# Altium schematic sheet 通讯部分(1).SchDoc
size 386 x 203 mm
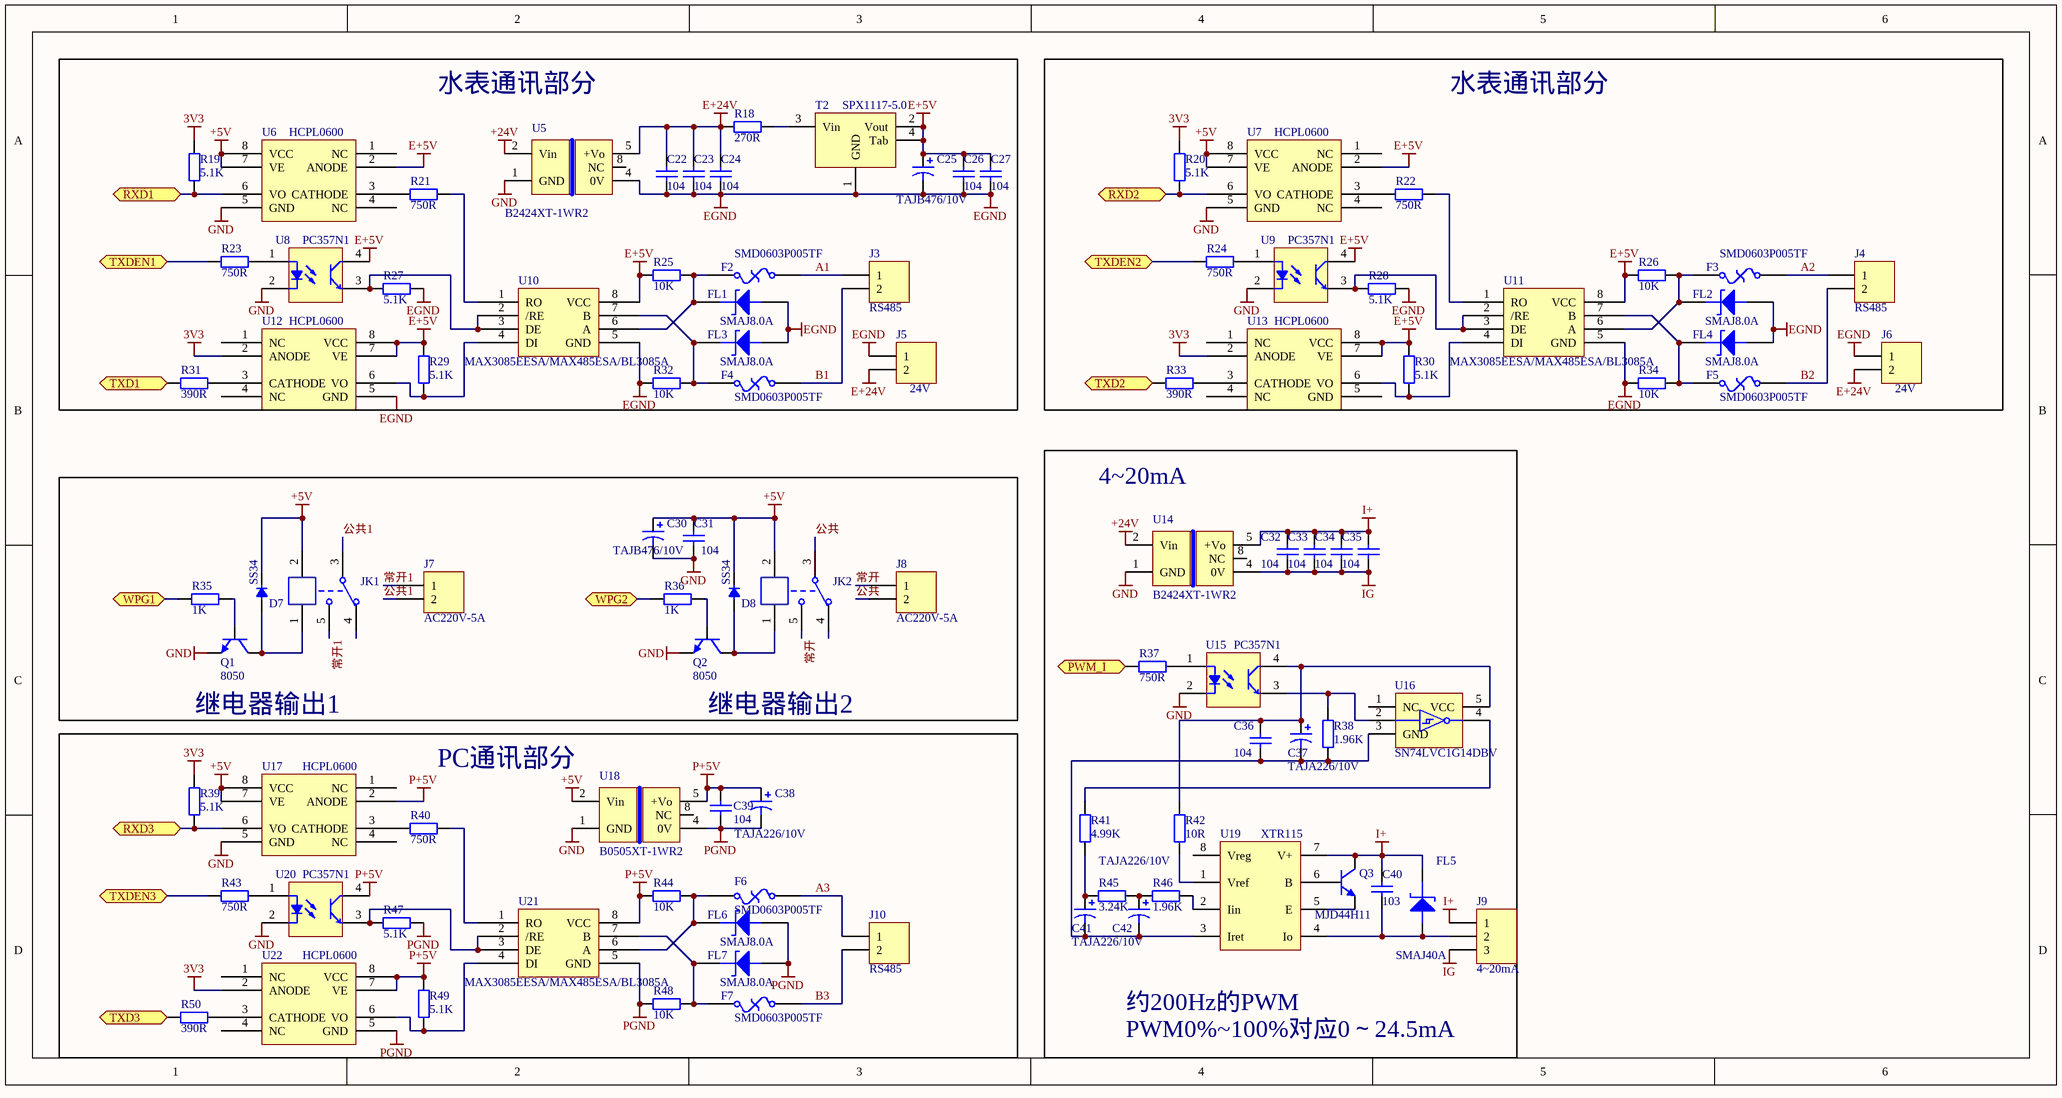
[diagram p0: 通讯部分(1).SchDoc]

## Parts
C22  104  [C 0603_M]
C23  104  [C 0603_M]
C24  104  [C 0603_M]
C25  TAJB476/10V  [3528]
C26  104  [C 0603_M]
C27  104  [C 0603_M]
C30  TAJB476/10V  [3528]
C31  104  [C 0603_M]
C32  104  [C 0603_M]
C33  104  [C 0603_M]
C34  104  [C 0603_M]
C35  104  [C 0603_M]
C36  104  [C 0603_M]
C37  TAJA226/10V  [3216]
C38  TAJA226/10V  [3216]
C39  104  [C 0603_M]
C40  103  [C 0603_M]
C41  TAJA226/10V  [3216]
C42  TAJA226/10V  [3216]
D7  SS34  [SMA]
D8  SS34  [SMA]
F2  SMD0603P005TF  [R 0603_M]
F3  SMD0603P005TF  [R 0603_M]
F4  SMD0603P005TF  [R 0603_M]
F5  SMD0603P005TF  [R 0603_M]
F6  SMD0603P005TF  [R 0603_M]
F7  SMD0603P005TF  [R 0603_M]
FL1  SMAJ8.0A  [SMA]
FL2  SMAJ8.0A  [SMA]
FL3  SMAJ8.0A  [SMA]
FL4  SMAJ8.0A  [SMA]
FL5  SMAJ40A  [SMA]
FL6  SMAJ8.0A  [SMA]
FL7  SMAJ8.0A  [SMA]
J3  RS485  [KF128-5.08-2P]
J4  RS485  [KF128-5.08-2P]
J5  24V  [KF128-5.08-2P]
J6  24V  [KF128-5.08-2P]
J7  AC220V-5A  [KF128-5.08-2P]
J8  AC220V-5A  [KF128-5.08-2P]
J9  4~20mA  [KF128-5.08-3P]
J10  RS485  [KF128-5.08-2P]
JK1  (no value)  [SRD-C_B]
JK2  (no value)  [SRD-C_B]
Q1  8050  [SOT-23]
Q2  8050  [SOT-23]
Q3  MJD44H11  [DPAK]
R18  270R  [R 1206_M]
R19  5.1K  [R 0603_M]
R20  5.1K  [R 0603_M]
R21  750R  [R 0603_M]
R22  750R  [R 0603_M]
R23  750R  [R 0603_M]
R24  750R  [R 0603_M]
R25  10K  [R 0603_M]
R26  10K  [R 0603_M]
R27  5.1K  [R 0603_M]
R28  5.1K  [R 0603_M]
R29  5.1K  [R 0603_M]
R30  5.1K  [R 0603_M]
R31  390R  [R 0603_M]
R32  10K  [R 0603_M]
R33  390R  [R 0603_M]
R34  10K  [R 0603_M]
R35  1K  [R 0603_M]
R36  1K  [R 0603_M]
R37  750R  [R 0603_M]
R38  1.96K  [R 0603_M]
R39  5.1K  [R 0603_M]
R40  750R  [R 0603_M]
R41  4.99K  [R 0603_M]
R42  10R  [R 0603_M]
R43  750R  [R 0603_M]
R44  10K  [R 0603_M]
R45  3.24K  [R 0603_M]
R46  1.96K  [R 0603_M]
R47  5.1K  [R 0603_M]
R48  10K  [R 0603_M]
R49  5.1K  [R 0603_M]
R50  390R  [R 0603_M]
T2  SPX1117-5.0  [SOT-223]
U5  B2424XT-1WR2  [B_XT-1W]
U6  HCPL0600  [SO-8]
U7  HCPL0600  [SO-8]
U8  PC357N1  [PC357]
U9  PC357N1  [PC357]
U10  MAX3085EESA/MAX485ESA/BL3085A  [SO-8]
U11  MAX3085EESA/MAX485ESA/BL3085A  [SO-8]
U12  HCPL0600  [SO-8]
U13  HCPL0600  [SO-8]
U14  B2424XT-1WR2  [B_XT-1W]
U15  PC357N1  [PC357]
U16  SN74LVC1G14DBV  [SOT23-5]
U17  HCPL0600  [SO-8]
U18  B0505XT-1WR2  [B_XT-1W]
U19  XTR115  [SO-8]
U20  PC357N1  [PC357]
U21  MAX3085EESA/MAX485ESA/BL3085A  [SO-8]
U22  HCPL0600  [SO-8]

## Blocks framed on the sheet
水表通讯部分: C22-C27 F2 F4 FL1 FL3 J3 J5 R18 R19 R21 R23 R25 R27 R29 R31 R32 T2 U5 U6 U8 U10 U12
水表通讯部分: F3 F5 FL2 FL4 J4 J6 R20 R22 R24 R26 R28 R30 R33 R34 U7 U9 U11 U13

## Ports
PWM_I (bidir), RXD1 (bidir), RXD2 (bidir), RXD3 (bidir), TXD1 (bidir), TXD2 (bidir), TXD3 (bidir), TXDEN1 (bidir), TXDEN2 (bidir), TXDEN3 (bidir), WPG1, WPG2

## Nets
3V3: R19.2 R20.2 R39.2 U12.2(ANODE) U13.2(ANODE) U22.2(ANODE)
+5V: C30.1 C31.2 D7.2 D8.2 JK1.2 JK2.2 U6.7(VE) U6.8(VCC) U7.7(VE) U7.8(VCC) U17.7(VE) U17.8(VCC) U18.2(Vin)
+24V: U5.2(Vin) U14.2(Vin)
E+5V: C25.1 C26.2 C27.2 R25.2 R26.2 R29.2 R30.2 T2.2(Vout) T2.4(Tab) U6.2(ANODE) U7.2(ANODE) U8.4 U9.4 U10.8(VCC) U11.8(VCC) U12.7(VE) U12.8(VCC) U13.7(VE) U13.8(VCC)
E+24V: C22.2 C23.2 C24.2 J5.2 J6.2 R18.2 U5.5(+Vo)
EGND: C22.1 C23.1 C24.1 C25.2 C26.1 C27.1 FL1.1(A) FL2.1(A) FL3.1(A) FL4.1(A) J5.1 J6.1 R27.2 R28.2 R32.2 R34.2 T2.1(GND) U5.4(0V) U10.5(GND) U11.5(GND) U12.5(GND)
GND: C30.2 C31.1 Q1.2(E) Q2.2(E) U5.1(GND) U6.5(GND) U7.5(GND) U8.2 U9.2 U14.1(GND) U15.2 U17.5(GND) U18.1(GND) U20.2
I+: C32.2 C33.2 C34.2 C35.2 C40.2 FL5.2(K) J9.1 Q3.2(C) U14.5(+Vo) U19.7(V+)
IG: C32.1 C33.1 C34.1 C35.1 J9.3 U14.4(0V)
P+5V: C38.1 C39.2 R44.2 R49.2 U17.2(ANODE) U18.5(+Vo) U20.4 U21.8(VCC) U22.7(VE) U22.8(VCC)
PGND: C38.2 C39.1 FL6.1(A) FL7.1(A) R47.2 R48.2 U18.4(0V) U21.5(GND) U22.5(GND)
A1: F2.1 J3.1
A2: F3.1 J4.1
A3: F6.1 J10.1
B1: F4.1 J3.2
B2: F5.1 J4.2
B3: F7.1 J10.2
PWM_I: R37.1 ; port PWM_I
RXD1: R19.1 U6.6(VO) ; port RXD1
RXD2: R20.1 U7.6(VO) ; port RXD2
RXD3: R39.1 U17.6(VO) ; port RXD3
TXD1: R31.1 ; port TXD1
TXD2: R33.1 ; port TXD2
TXD3: R50.1 ; port TXD3
TXDEN1: R23.1 ; port TXDEN1
TXDEN2: R24.1 ; port TXDEN2
TXDEN3: R43.1 ; port TXDEN3
WPG1: R35.1 ; port WPG1
WPG2: R36.1 ; port WPG2
公共: J8.2 JK2.3
公共1: J7.2 JK1.3
常开: J8.1 JK2.5
常开1: J7.1 JK1.5
NetC36_1: C36.1 C37.2 C41.2 C42.2 R38.1 U16.3(GND) U19.3(Iret)
NetC36_2: C36.2 C37.1 R42.2 U15.4 U16.5(VCC)
NetC40_1: C40.1 FL5.1(A) J9.2 U19.4(Io)
NetC41_1: C41.1 R41.1 R45.1
NetC42_1: C42.1 R45.2 R46.1
NetD7_1: D7.1 JK1.1 Q1.3(C)
NetD8_1: D8.1 JK2.1 Q2.3(C)
NetF2_2: F2.2 FL1.2(K) R25.1 U10.6(A)
NetF3_2: F3.2 FL2.2(K) R26.1 U11.6(A)
NetF4_2: F4.2 FL3.2(K) R32.1 U10.7(B)
NetF5_2: F5.2 FL4.2(K) R34.1 U11.7(B)
NetF6_2: F6.2 FL6.2(K) R44.1 U21.6(A)
NetF7_2: F7.2 FL7.2(K) R48.1 U21.7(B)
NetQ1_1: Q1.1(B) R35.2
NetQ2_1: Q2.1(B) R36.2
NetQ3_1: Q3.1(B) U19.6(B)
NetQ3_3: Q3.3(E) U19.5(E)
NetR18_1: R18.1 T2.3(Vin)
NetR21_1: R21.1 U6.3(CATHODE)
NetR21_2: R21.2 U10.1(RO)
NetR22_1: R22.1 U7.3(CATHODE)
NetR22_2: R22.2 U11.1(RO)
NetR23_2: R23.2 U8.1
NetR24_2: R24.2 U9.1
NetR27_1: R27.1 U8.3 U10.2(/RE) U10.3(DE)
NetR28_1: R28.1 U9.3 U11.2(/RE) U11.3(DE)
NetR29_1: R29.1 U10.4(DI) U12.6(VO)
NetR30_1: R30.1 U11.4(DI) U13.6(VO)
NetR31_2: R31.2 U12.3(CATHODE)
NetR33_2: R33.2 U13.3(CATHODE)
NetR37_2: R37.2 U15.1
NetR38_2: R38.2 U15.3 U16.2
NetR40_1: R40.1 U17.3(CATHODE)
NetR40_2: R40.2 U21.1(RO)
NetR41_2: R41.2 U16.4
NetR42_1: R42.1 U19.1(Vref)
NetR43_2: R43.2 U20.1
NetR46_2: R46.2 U19.2(Iin)
NetR47_1: R47.1 U20.3 U21.2(/RE) U21.3(DE)
NetR49_1: R49.1 U21.4(DI) U22.6(VO)
NetR50_2: R50.2 U22.3(CATHODE)

Not connected (* = marked no-connect by the designer): JK1 4; JK2 4; U5 8(NC); U6 1(NC) 4(NC); U7 1(NC) 4(NC); U12 1(NC) 4(NC); U13 1(NC) 4(NC) 5(GND); U14 8(NC); U16 1(NC); U17 1(NC) 4(NC); U18 8(NC); U19 8(Vreg); U22 1(NC) 4(NC)

## Notes on the sheet
- 4~20mA
- (near Q1) 继电器输出1
- PC通讯部分
- (near Q2) 继电器输出2
- PWM0%~100%对应0～24.5mA
- 约200Hz的PWM

## Library data of the parts
C22-C24 C26 C27 C31-C36 C39 C40 = Cap Semi: Capacitor (Semiconductor SIM Model); Published: 8-Jun-2000; LatestRevisionDate: 17-Jul-2002; LatestRevisionNote: Re-released for DXP Platform.; PackageReference: C1206; Publisher: Altium Limited
C25 C30 C37 C38 C41 C42 = Cap Pol1: Polarized Capacitor (Radial); Published: 8-Jun-2000; LatestRevisionDate: 17-Jul-2002; LatestRevisionNote: Re-released for DXP Platform.; PackageReference: RB7.6-15; Publisher: Altium Limited
D7 D8 = D: Value: 4007; Published: 8-Jun-2000; LatestRevisionDate: 17-Jul-2002; LatestRevisionNote: Re-released for DXP Platform.; PackageVersion: Sep-1996; PackageReference: SMC; Publisher: Altium Limited; PackageDescription: DO-214-AB/SMC; 2 C-Bend Leads; Body 7.9 x 5.9 mm, inc. leads (LxW); Code_JEDEC: DO-214-AB
F2-F7 = Fuse Thermal: Thermal Fuse; Published: 24-Mar-1999; LatestRevisionDate: 17-Jul-2002; LatestRevisionNote: Re-released for DXP Platform.; PackageReference: PIN-W2/E2.8; Publisher: 50mA
FL1-FL7 = ZENER2: Zener Diode
J3-J8 J10 = Header 2: Header, 2-Pin; LatestRevisionDate: 17-Jul-2002; LatestRevisionNote: Re-released for DXP Platform.; Publisher: Altium Limited
J9 = Header 3: Header, 3-Pin; LatestRevisionDate: 17-Jul-2002; LatestRevisionNote: Re-released for DXP Platform.; Publisher: Altium Limited
JK1 JK2 = SRD-05VDC-SL-C: 5V单路双控继电器; BOM名称: 5V继电器; 版权归属: 源创客; 学习资源: www.ooocke.com
Q1 Q2 = NPN
Q3 = MJD44H11: NPN Bipolar Transistor; Published: 8-Jun-2000; LatestRevisionDate: 17-Jul-2002; LatestRevisionNote: Re-released for DXP Platform.; PackageReference: TO-226; Publisher: Altium Limited; Code_JEDEC: TO-226-AA
R18-R50 = Res2: Resistor; Published: 8-Jun-2000; LatestRevisionDate: 17-Jul-2002; LatestRevisionNote: Re-released for DXP Platform.; PackageReference: AXIAL-0.4; Publisher: Altium Limited
T2 = 1117
U5 U14 U18 = B_XT-1W
U6 U7 U12 U13 U17 U22 = 6N137
U8 U9 U15 U20 = TLP521-1
U10 U11 U21 = MAX485